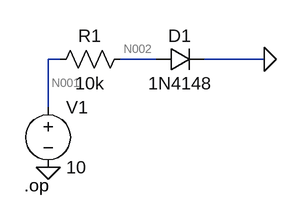
[diagram p0: schematic Draft5.asc]
Draft5.asc, the LTspice schematic file:
Version 4
SHEET 1 880 680
WIRE 16 112 0 112
WIRE 144 112 96 112
WIRE 288 112 208 112
WIRE 0 176 0 112
FLAG 0 256 0
FLAG 288 112 0
SYMBOL diode 144 128 R270
WINDOW 0 32 32 VTop 2
WINDOW 3 0 32 VBottom 2
SYMATTR InstName D1
SYMATTR Value 1N4148
SYMBOL voltage 0 160 R0
WINDOW 123 0 0 Left 0
WINDOW 39 0 0 Left 0
SYMATTR InstName V1
SYMATTR Value 10
SYMBOL res 112 96 R90
WINDOW 0 0 56 VBottom 2
WINDOW 3 32 56 VTop 2
SYMATTR InstName R1
SYMATTR Value 10k
TEXT -32 280 Left 2 !.op

The netlist it stands for:
* Draft5.asc
D1 N002 0 1N4148
V1 N001 0 10
R1 N002 N001 10k
.model D D
.lib standard.dio
.op
.backanno
.end

* Results of the author's LTspice run, read from the files saved beside the schematic
* Operating Point:
*   V(n002) = 582 mV
*   V(n001) = 10 V
*   I(D1) = 941.8 µA
*   I(R1) = -941.8 µA
*   I(V1) = -941.8 µA
* From the log:
*   Semiconductor Device Operating Points:
*                           --- Diodes ---
*   Name:      d1
*   Model:   1n4148
*   Id:      9.42e-04
*   Vd:      5.82e-01
*   Req:     4.81e+01
*   CAP:     4.21e-10